# Altium schematic sheet output.SchDoc
size A4
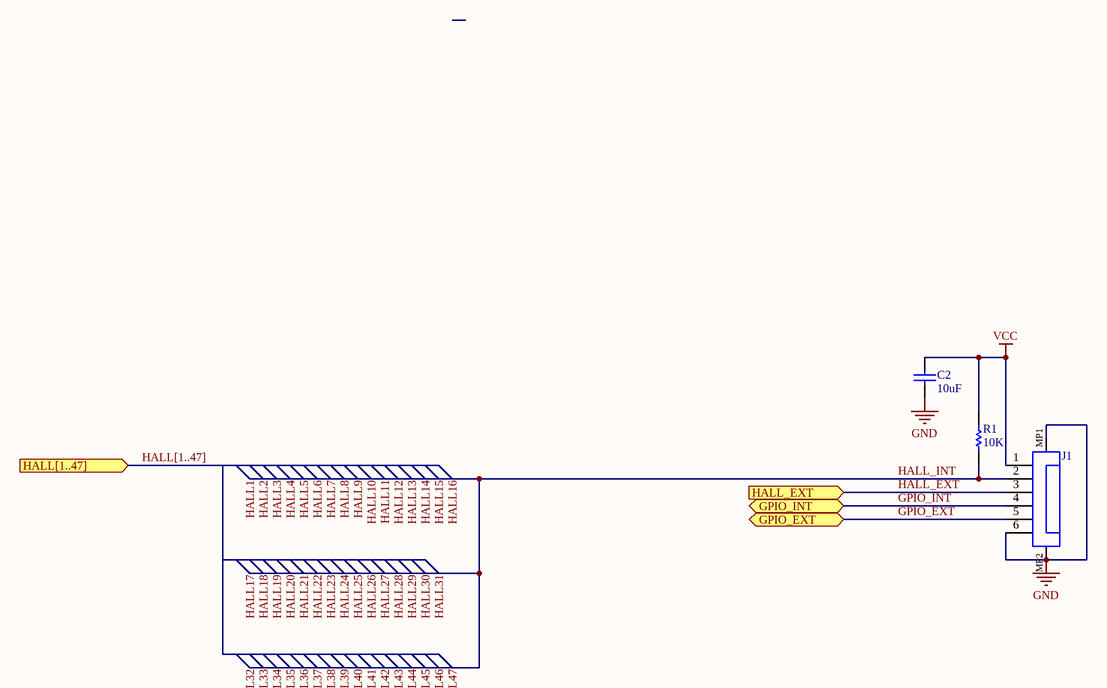
[diagram p0: output.SchDoc]

## Parts
C2  10uF  [CAPC2013X140X50LL20T25]
J1  68610614422  [68610614422]  (value not drawn)
R1  10K  [RESC1608X55X30LL15T15]

## Ports
GPIO_EXT (bidir), GPIO_INT (bidir), HALL[1..47] (in), HALL_EXT (in)

## Nets
GND: C2.1 J1.6 J1.MP1 J1.MP2
VCC: C2.2 J1.1 R1.2
GPIO_EXT: J1.5 ; port GPIO_EXT
GPIO_INT: J1.4 ; port GPIO_INT
HALL1: J1.2 R1.1  [also labelled HALL10, HALL11, HALL12, HALL13, HALL14, HALL15, HALL16, HALL17, HALL18, HALL19, HALL2, HALL20, HALL21, HALL22, HALL23, HALL24, HALL25, HALL26, HALL27, HALL28, HALL29, HALL3, HALL30, HALL31, HALL32, HALL33, HALL34, HALL35, HALL36, HALL37, HALL38, HALL39, HALL4, HALL40, HALL41, HALL42, HALL43, HALL44, HALL45, HALL46, HALL47, HALL5, HALL6, HALL7, HALL8, HALL9, HALL_INT]
HALL_EXT: J1.3 ; port HALL_EXT

## Buses and harness runs
bus HALL[1..47] = port HALL[1..47]

## Library data of the parts
C2 = CMP-2007-03243-1: Part Number: C0805C106K8PACTU; Manufacturer: Kemet
J1 = CMP-1502-01454-1: SMT ZIF Connectors WR-FPC, Horizontal, Bottom Contact, pitch 1 mm, 6 pins; Manufacturer: Wurth Elektronik; Contact Resistance: 20mOhm; Rated Current: 1A; Pitch: 1mm; Withstanding Voltage: 500VAC; Working Voltage: 125VAC; Pin Number: 6; Operating Temperature: -25to85degC; Packaging: TapeandReel; Contact Design: BottomContact; Manufacturer URL: http://www.we-online.de; Part Number: 68610614422; Publisher: WurthElektronik; Package Reference: 68610614422; Datasheet URL: https://katalog.we-online.de/em/datasheet/68610614422.pdf; Mounting Technology: SMT; Orientation: Horizontal; System: Connector
R1 = CMP-2000-00181-1: Part Number: ERJ-3EKF1002V; Manufacturer: Panasonic